# EasyEDA Pro project servo_singal_board.eprj

# Schematic Schematic1
Create Date: 2024-05-10; Page Name: P1; Project Name: servo_singal_board; Schematic Name: Schematic1; Update Date: 2024-05-11; Company: 嘉立创EDA; Page Size: A4; Version: V1.0
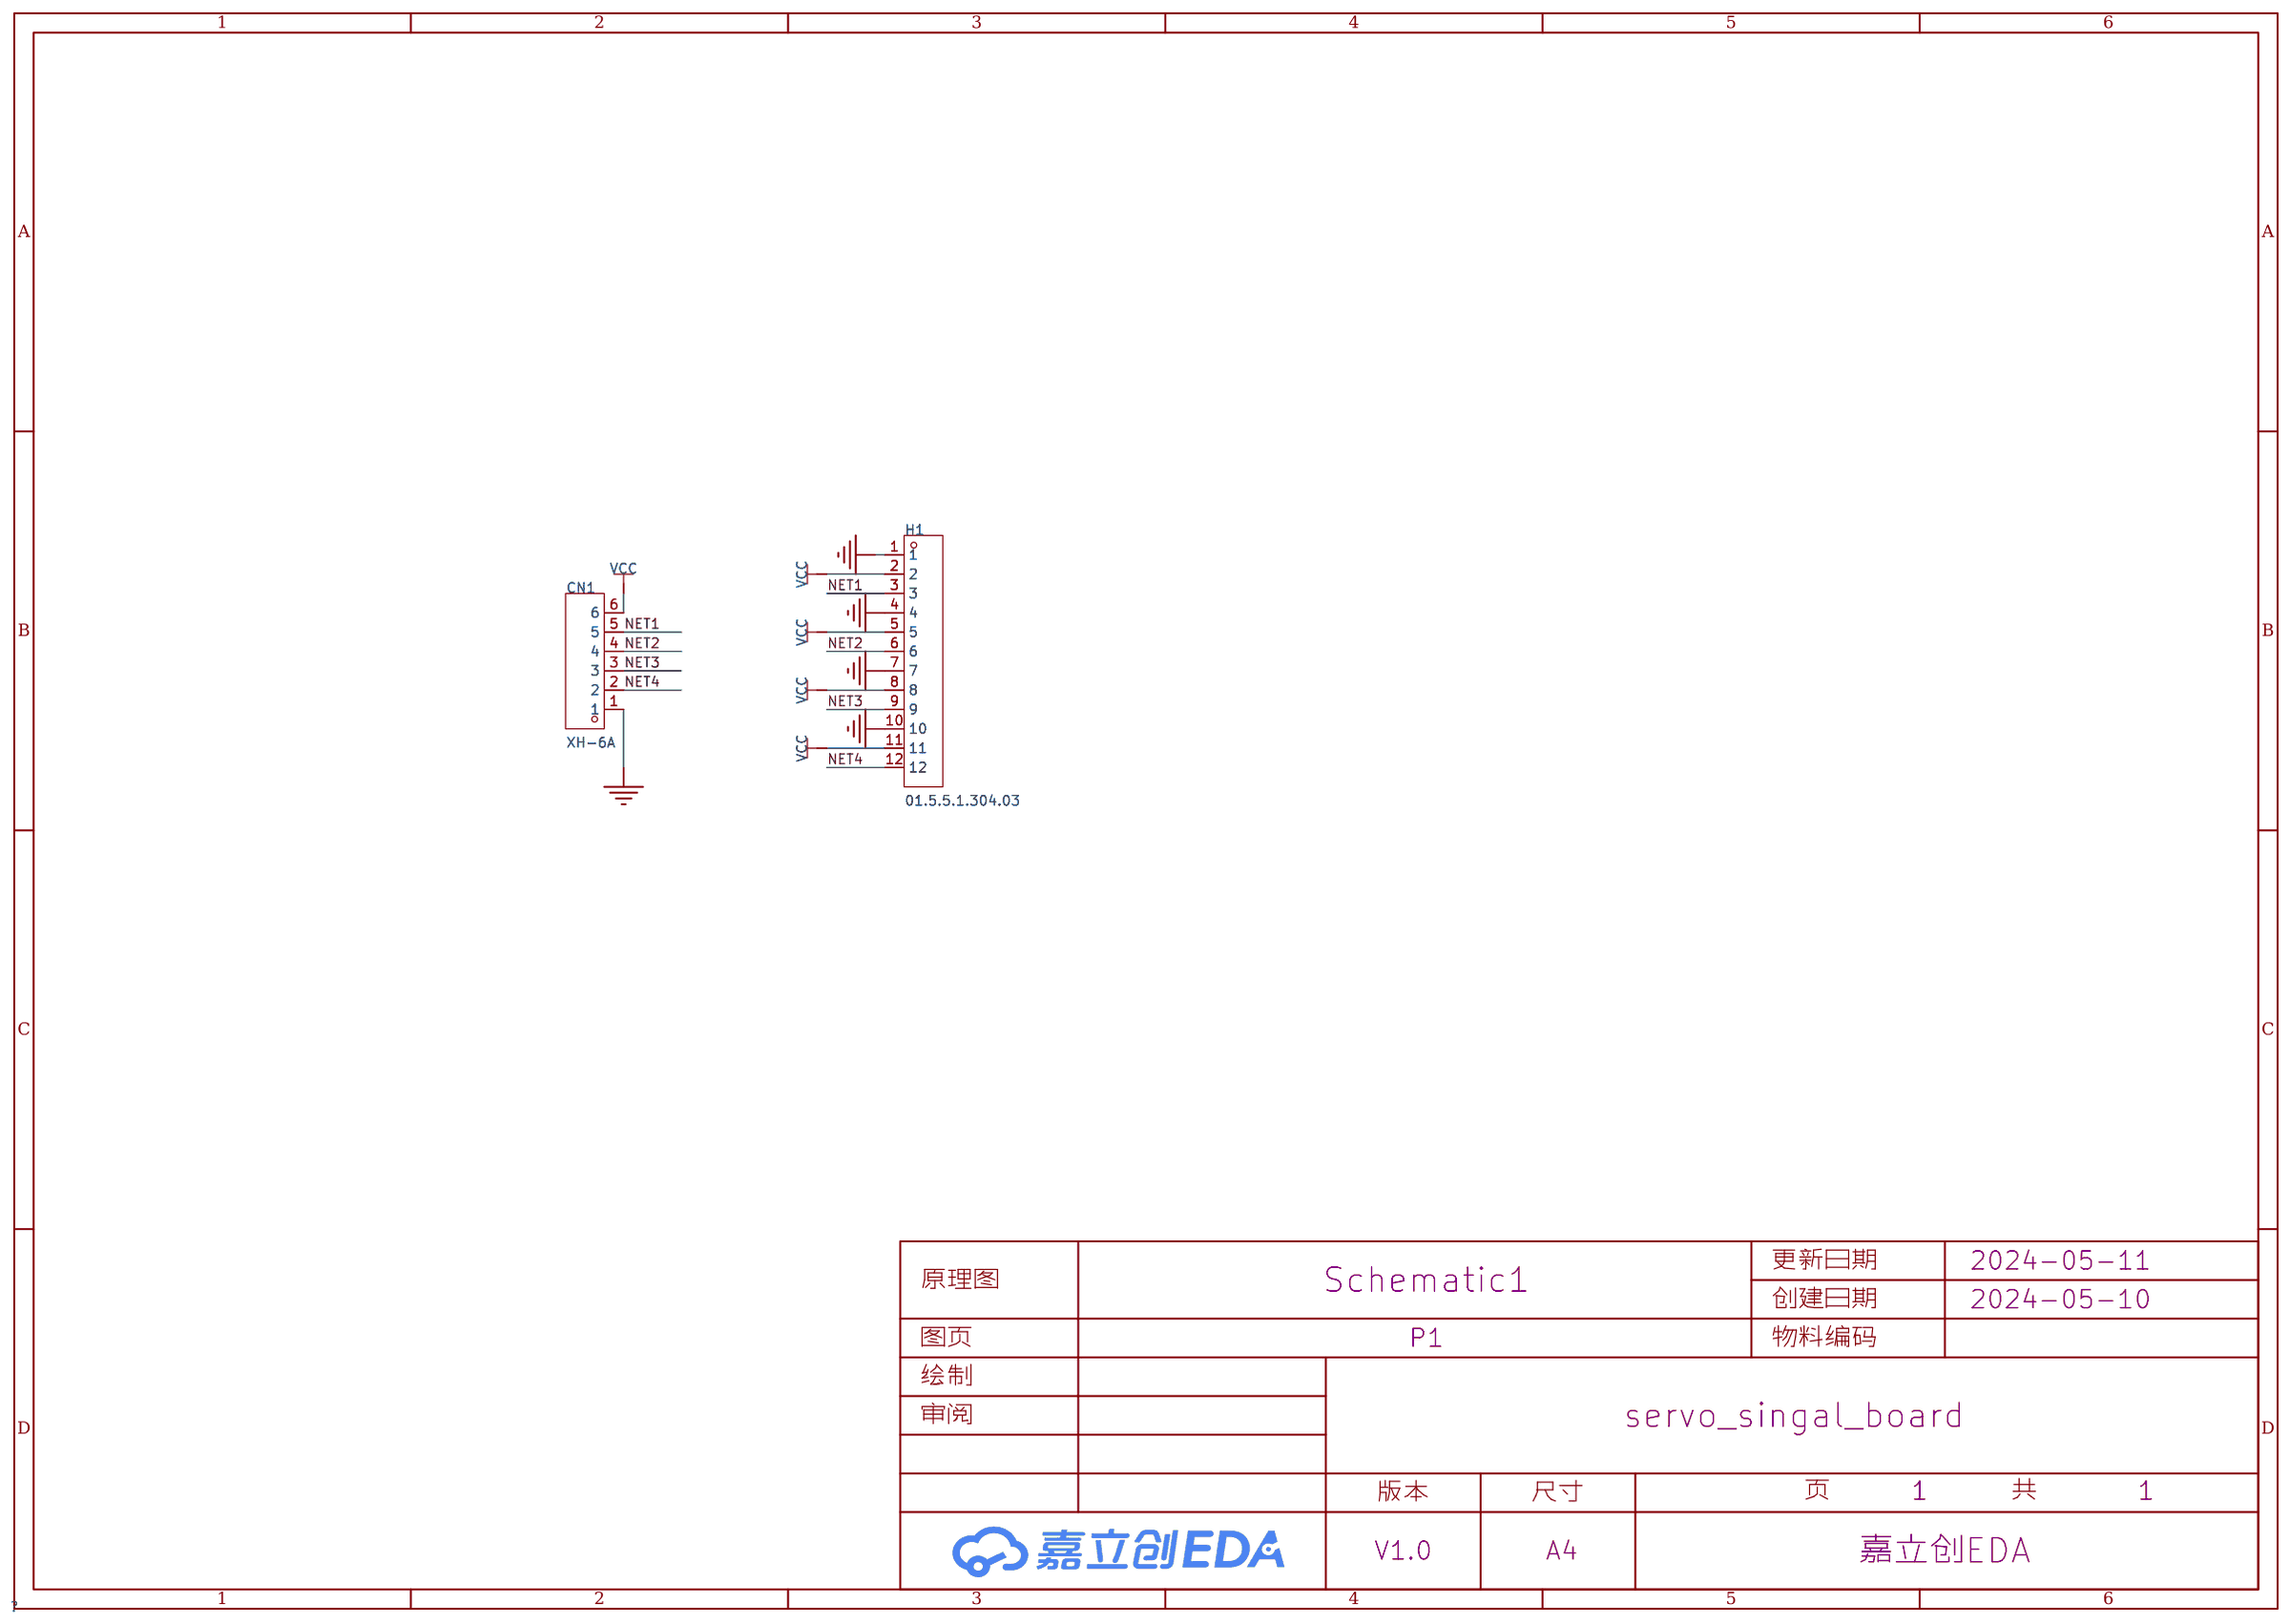
[diagram p0: schematic sheet]

## Parts
CN1  XH-6A  [CONN-TH_6P-P2.50_HCTL_XH-6A_C2908604]
H1  01.5.5.1.304.03  [HDR-TH_12P-P2.54-V-M-R3-C4-S2.54]

## Library data of the parts
CN1 = XH-6A: 插针结构:1x6P;间距:2.5mm;安装方式:直插;参考系列:XH;总PIN数:6P;排数:1;每排PIN数:6;行距:-;额定电流:3A;触头材质:黄铜;触头镀层:锡;工作温度范围:-25℃~+85℃;; LCSC Part Name: 1x6P 间距:2.5mm 直插 系列:XH; Supplier Part: C2908604; Manufacturer: HCTL(华灿天禄); Supplier Footprint: 插件,P=2.5mm; JLCPCB Part Class: 扩展库; Datasheet: https://atta.szlcsc.com/upload/public/pdf/source/20230711/68D365716984B4AFE576D1D73D61B465.pdf; Supplier: LCSC; Pins Structure: 1x6P; Pitch: 2.5mm; Mounting Style: 直插; Reference Series: XH; Number of Pins: 6P; Number of Rows: 1; Number of PINs Per Row: 6; Current Rating (Max): 3A; Contact Material: 黄铜; Contact Plating: 锡; Operating Temperature Range: -25℃~+85℃
H1 = 01.5.5.1.304.03: 插针结构:3x4P;间距:2.54mm;行距:2.54mm;圆针/方针:方针;安装类型:直插;排数:三排;总PIN位数:12P;额定电流:3A;额定电压:-;配合针长度:-;塑高:2.54mm;端接针长度:-;工作温度范围:-40℃~+105℃;颜色:-;; LCSC Part Name: 间距:2.54mm 3x4P 直插 方针; Supplier Part: C2937160; Manufacturer: RealRun(惟赞); Supplier Footprint: 插件,P=2.54mm; JLCPCB Part Class: 扩展库; Datasheet: https://atta.szlcsc.com/upload/public/pdf/source/20211223/1BFB316421705FEBD20912B6CCD7E0CB.pdf; Supplier: LCSC; Pin Structure: 3x4P; Pitch: 2.54mm; Row Spacing: 2.54mm; Circluar Pins/Square Pins: 方针; Mounting Type: 直插; Number of Rows: 三排; Number of Pins: 12P; Current Rating (Max): 3A; Insulation Height: 2.54mm; Operating Temperature Range: -40℃~+105℃

## Nets
GND: CN1.1 H1.1 H1.4 H1.7 H1.10
VCC: CN1.6 H1.2 H1.5 H1.8 H1.11
NET1: CN1.5 H1.3
NET2: CN1.4 H1.6
NET3: CN1.3 H1.9
NET4: CN1.2 H1.12

# Board PCB1
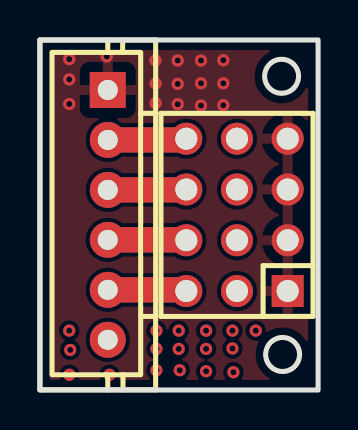
[diagram p1: board, top side]
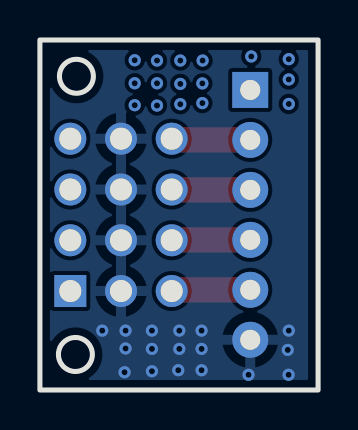
[diagram p2: board, bottom side, seen from below]

Outline 13.94 x 17.51 mm; copper layers: Top Layer, Bottom Layer. Coordinates in mm from the lower left corner of the outline.
Outline path: rectangle 0,17.51 13.94,0 ; circle c12.11,15.7 r0.85 ; circle c12.16,1.78 r0.85
Stack: Top Layer 0.035mm / Dielectric1 1.51mm FR4 er 4.5 / Bottom Layer 0.035mm

## Design rules (mm)
template: JLCPCB Capability(Two Layers Board)
spacing copperThickness1oz (default): track to track 0.102, other pairs 0.152 to 0.3
spacing copperThickness2oz: track to track 0.203, other pairs 0.152 to 0.3
track width copperThickness1oz (default): min 0.127, default 0.254, max 2.54
track width copperThickness2oz: min 0.203, default 0.254, max 2.54
differential pair differentialPair (default): width min 0.127, default 0.254, max 2.54; gap min 0.152, default 0.152
via viaSize (default): diameter min 0.5, default 0.61, max 10; hole min 0.3, default 0.305, max 6.3

## Placement (name value [footprint] x y rotation side)
CN1  XH-6A  [CONN-TH_6P-P2.50_HCTL_XH-6A_C2908604]  3.4 8.76 270 top
H1  01.5.5.1.304.03  [HDR-TH_12P-P2.54-V-M-R3-C4-S2.54]  9.88 8.76 90 top

## Footprints (pads in the part's own frame, mm; a bottom-side part is the same pattern mirrored in y, then rotated)
CONN-TH_6P-P2.50_HCTL_XH-6A_C2908604
  rect 1.8x1.8 hole 1: 1(-6.25,0.001)
  round 1.8 hole 1: 2(-3.749,0.001) 3(-1.25,0.001) 4(1.25,0) 5(3.75,-0.001) 6(6.25,-0.001)
HDR-TH_12P-P2.54-V-M-R3-C4-S2.54
  rect 1.6x1.6 hole 1.1: 1(-3.81,-2.54)
  round 1.6 hole 1.1: 2(-3.81,0) 3(-3.81,2.54) 4(-1.27,-2.54) 5(-1.27,0) 6(-1.27,2.54) 7(1.27,-2.54) 8(1.27,0) 9(1.27,2.54) 10(3.81,-2.54) 11(3.81,0) 12(3.81,2.54)

## Nets
As in the schematic.

## Via types
v1: diameter 0.61, hole 0.305, Top Layer to Bottom Layer, 33 vias

## Routing (per net, layer and track width the routed paths; a pad name or vN(x,y) marks a point on that pad's centre or on a via; arc(x,y) is an arc through that point)
GND:
  vias: v1(1.47,16.55) v1(1.47,15.54) v1(1.47,14.31) v1(3.35,16.69) v1(5.79,16.48) v1(5.8,15.34) v1(5.8,14.36) v1(6.91,16.48) v1(6.91,15.32) v1(6.91,14.3) v1(8.07,16.48) v1(8.07,15.35) v1(8.07,14.23) v1(9.19,16.5) v1(9.19,15.35) v1(9.19,14.25)
VCC:
  vias: v1(1.47,2.97) v1(1.52,2.01) v1(1.48,0.76) v1(3.49,0.76) v1(5.84,2.97) v1(5.84,2.06) v1(5.84,0.99) v1(6.96,2.97) v1(6.96,2.06) v1(7.01,0.99) v1(8.33,2.97) v1(8.33,2.06) v1(8.33,0.94) v1(9.65,2.97) v1(9.65,2.08) v1(9.7,0.89) v1(10.82,2.97)
NET1: length 4
  Top Layer w1.27: H1.3 7.28,5.01 CN1.5
NET2: length 3.9
  Top Layer w1.27: CN1.4 7.32,7.51 H1.6
NET3: length 3.9
  Top Layer w1.27: CN1.3 7.32,10.01 H1.9
NET4: length 4
  Top Layer w1.27: H1.12 7.28,12.51 CN1.2

## Copper pours and planes (outline as drawn; the poured copper is in the pictures)
GND on Top Layer: -5.59,20.9 22.09,20.9 22.09,-3.48 -5.59,-3.48
VCC on Bottom Layer: -1.63,19.08 20.47,19.08 20.47,-1.8 -1.63,-1.8
